# EAGLE design node (EAGLE 9.6.2)
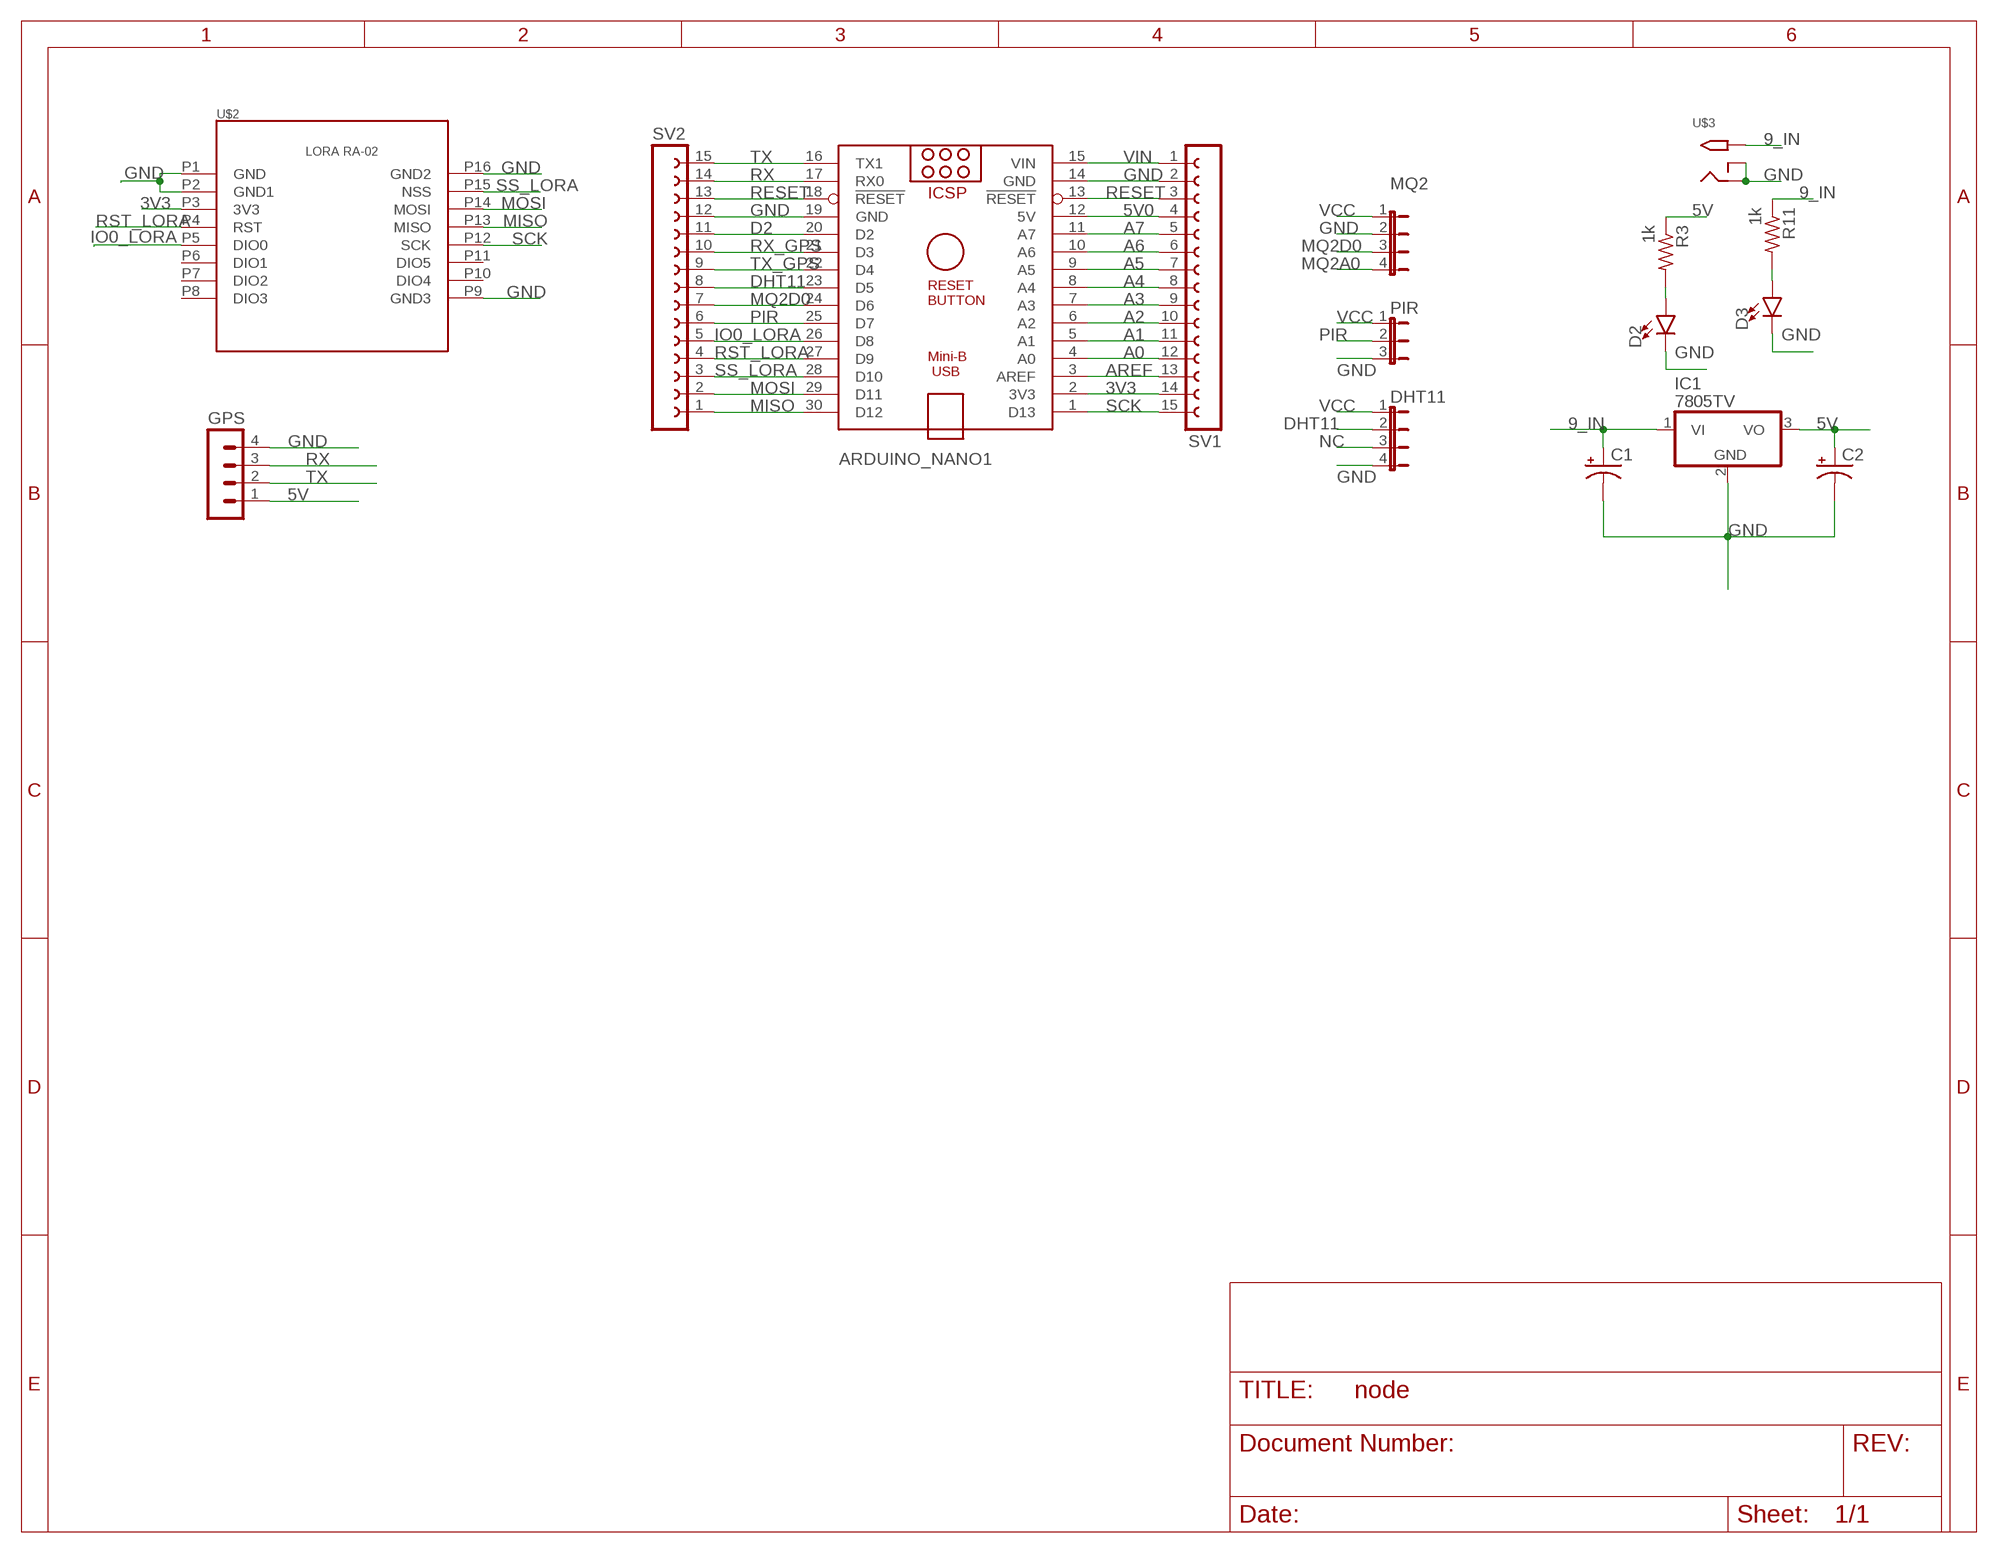
[diagram p0: schematic, sheet 1]

## Parts
ARDUINO_NANO1  ARDUINO_NANO  [ARDUINO_NANO]
C1  CPOL-USE3.5-8  [E3,5-8]
C2  CPOL-USE3.5-8  [E3,5-8]
D2  LED3MM  [LED_3MM]
D3  LED3MM  [LED_3MM]
DHT11  JP4E  [JP4]
GPS  MA04-1  [MA04-1]
IC1  7805TV  [TO220V]
MQ2  JP4E  [JP4]
PIR  JP2E  [JP2]
R3  1k  R-US_M0805  [M0805]
R11  1k  R-US_M0805  [M0805]
SV1  FE15-1  [FE15]
SV2  FE15-1  [FE15]
U$2  LORA_RA-02  [RA-02]
U$3  2.1MMJACKTHM  [PJ-102A]

## Nets
3V3: ARDUINO_NANO1.2(3V3) SV1.14 U$2.P3(3V3)
5V: C2.+ GPS.1 IC1.3(VO) R3.1
5V0: ARDUINO_NANO1.12(5V) SV1.4
9_IN: C1.+ IC1.1(VI) R11.1 U$3.TIP
A0: ARDUINO_NANO1.4(A0) SV1.12
A1: ARDUINO_NANO1.5(A1) SV1.11
A2: ARDUINO_NANO1.6(A2) SV1.10
A3: ARDUINO_NANO1.7(A3) SV1.9
A4: ARDUINO_NANO1.8(A4) SV1.8
A5: ARDUINO_NANO1.9(A5) SV1.7
A6: ARDUINO_NANO1.10(A6) SV1.6
A7: ARDUINO_NANO1.11(A7) SV1.5
AREF: ARDUINO_NANO1.3(AREF) SV1.13
D2: ARDUINO_NANO1.20(D2) SV2.11
DHT11: ARDUINO_NANO1.23(D5) DHT11.2 SV2.8
GND: ARDUINO_NANO1.14(GND) ARDUINO_NANO1.19(GND) C1.- C2.- D2.K(C) D3.K(C) DHT11.4 GPS.4 IC1.2(GND) MQ2.2 PIR.3 SV1.2 SV2.12 U$2.P1(GND) U$2.P2(GND1) U$2.P9(GND3) U$2.P16(GND2) U$3.RING U$3.RING_SW
IO0_LORA: ARDUINO_NANO1.26(D8) SV2.5 U$2.P5(DIO0)
MISO: ARDUINO_NANO1.30(D12) SV2.1 U$2.P13(MISO)
MOSI: ARDUINO_NANO1.29(D11) SV2.2 U$2.P14(MOSI)
MQ2A0: MQ2.4
MQ2D0: ARDUINO_NANO1.24(D6) MQ2.3 SV2.7
N$2: D3.A R11.2
N$5: D2.A R3.2
NC: DHT11.3
PIR: ARDUINO_NANO1.25(D7) PIR.2 SV2.6
RESET: ARDUINO_NANO1.13(!RESET) ARDUINO_NANO1.18(!RESET) SV1.3 SV2.13
RST_LORA: ARDUINO_NANO1.27(D9) SV2.4 U$2.P4(RST)
RX: ARDUINO_NANO1.17(RX0) GPS.3 SV2.14
RX_GPS: ARDUINO_NANO1.21(D3) SV2.10
SCK: ARDUINO_NANO1.1(D13) SV1.15 U$2.P12(SCK)
SS_LORA: ARDUINO_NANO1.28(D10) SV2.3 U$2.P15(NSS)
TX: ARDUINO_NANO1.16(TX1) GPS.2 SV2.15
TX_GPS: ARDUINO_NANO1.22(D4) SV2.9
VCC: DHT11.1 MQ2.1 PIR.1
VIN: ARDUINO_NANO1.15(VIN) SV1.1
Unconnected: U$2.P6(DIO1) U$2.P7(DIO2) U$2.P8(DIO3) U$2.P10(DIO4) U$2.P11(DIO5)

## Library data of the parts
ARDUINO_NANO1 = ArduinoNanoV30:ARDUINO_NANO: Arduino Nano V3.0 Overview: The Arduino Nano is a small, complete, and breadboard-friendly board based on the ATmega328 (Arduino Nano 3.x) or ATmega168 (Arduino Nano 2.x). It has more or less the same functionality of the Arduino Duemilanove, but in a different package. It lacks only a DC power jack, and works with a Mini-B USB cable instead of a standard one. The Nano was designed and is being produced by Gravitech. Specifications: Microcontroller Atmel ATmega168 or ATmega328 Operating Voltage (logic level) 5 V Input Voltage (recommended) 7-12 V Input Voltage (limits) 6-20 V Digital I/O Pins 14 (of which 6 provide PWM output) Analog Input Pins 8 DC Current per I/O Pin 40 mA Flash Memory 16 KB (ATmega168) or 32 KB (ATmega328) of which 2 KB used by bootloader SRAM 1 KB (ATmega168) or 2 KB (ATmega328) EEPROM 512 bytes (ATmega168) or 1 KB (ATmega328) Clock Speed 16 MHz Dimensions 0.73" x 1.70" Length 45 mm Width 18 mm Weigth 5 g Power: The Arduino Nano can be powered via the Mini-B USB connection, 6-20V unregulated external power supply (pin 30), or 5V regulated external power supply (pin 27). The power source is automatically selected to the highest voltage source. Memory: The ATmega168 has 16 KB of flash memory for storing code (of which 2 KB is used for the bootloader); the ATmega328 has 32 KB, (also with 2 KB used for the bootloader). The ATmega168 has 1 KB of SRAM and 512 bytes of EEPROM (which can be read and written with the EEPROM library); the ATmega328 has 2 KB of SRAM and 1 KB of EEPROM. Input and Output: Each of the 14 digital pins on the Nano can be used as an input or output, using pinMode(), digitalWrite(), and digitalRead() functions. They operate at 5 volts. Each pin can provide or receive a maximum of 40 mA and has an internal pull-up resistor (disconnected by default) of 20-50 kOhms. In addition, some pins have specialized functions. Visit Arduino - ArduinoBoardNano <https://www.arduino.cc/en/Main/ArduinoBoardNano>
C1 C2 = adafruit:CPOL-US: POLARIZED CAPACITOR, American symbol
D2 D3 = SparkFun-LED:LED: LED (Generic) Standard schematic elements and footprints for 5mm, 3mm, 1206, and 0603 sized LEDs. Generic LEDs with no color specified.; PROD_ID: DIO-08794
DHT11 MQ2 = jumper:JP4E: JUMPER
GPS = con-lstb:MA04-1: PIN HEADER; OC_FARNELL: unknown; OC_NEWARK: unknown
IC1 = linear:78*: Positive VOLTAGE REGULATOR Source: http://cache.national.com/ds/LM/LM78L05.pdf http://www.fairchildsemi.com/ds/LM/LM7805.pdf
PIR = jumper:JP2E: JUMPER
R3 R11 = adafruit:R-US_: RESISTOR, American symbol
SV1 SV2 = con-lsta:FE15-1: FEMALE HEADER; OC_FARNELL: unknown; OC_NEWARK: unknown
U$2 = LORA RA-02:LORA_RA-02
U$3 = adafruit:2.1MMJACK: 2.1mm x 5.5mm THM DC jack with internal switch. Digikey part #PJ-102A, 4UCON part #05537 2.1mm x 5.5mm SMT DC jack with internal switch. Digikey part #PJ-002A-SMT, 4UCON part #03267 By microbuilder.eu & adafruit.com

## Board
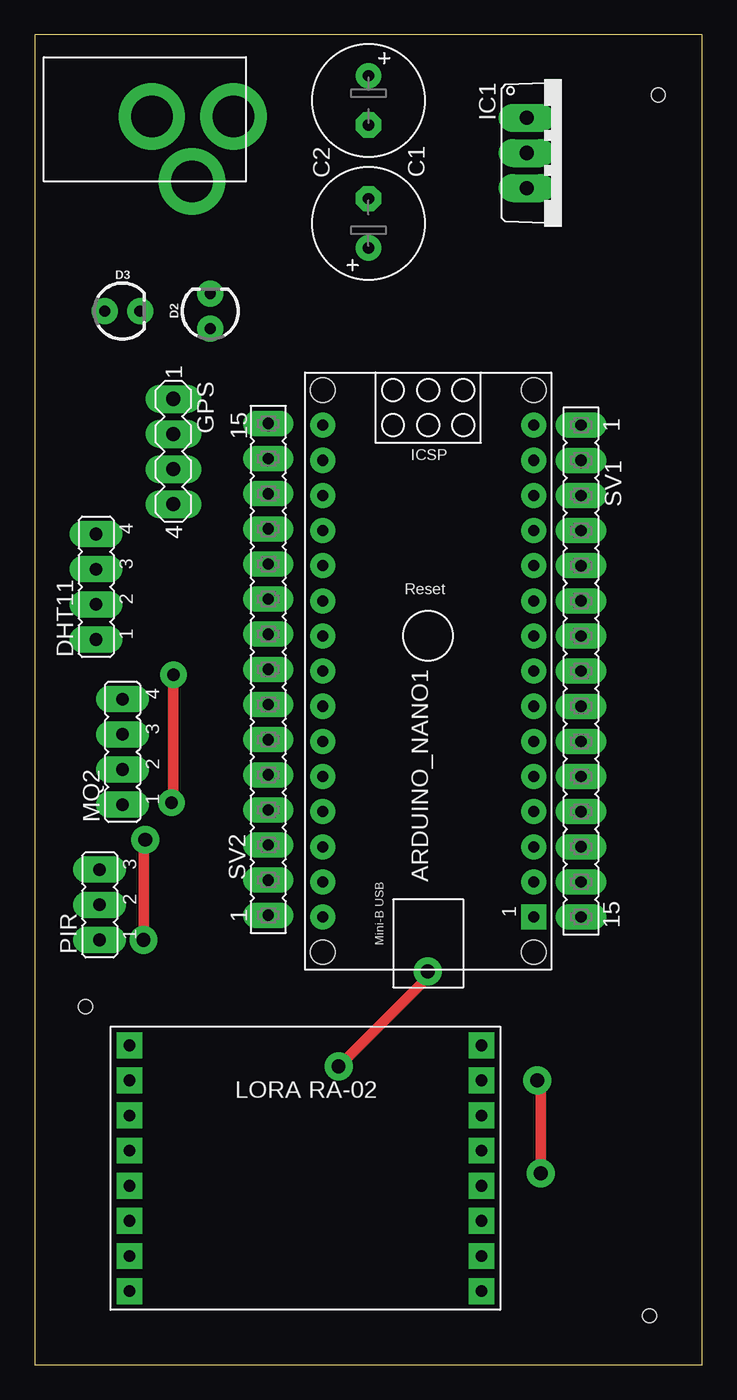
[diagram p1: board, top side]
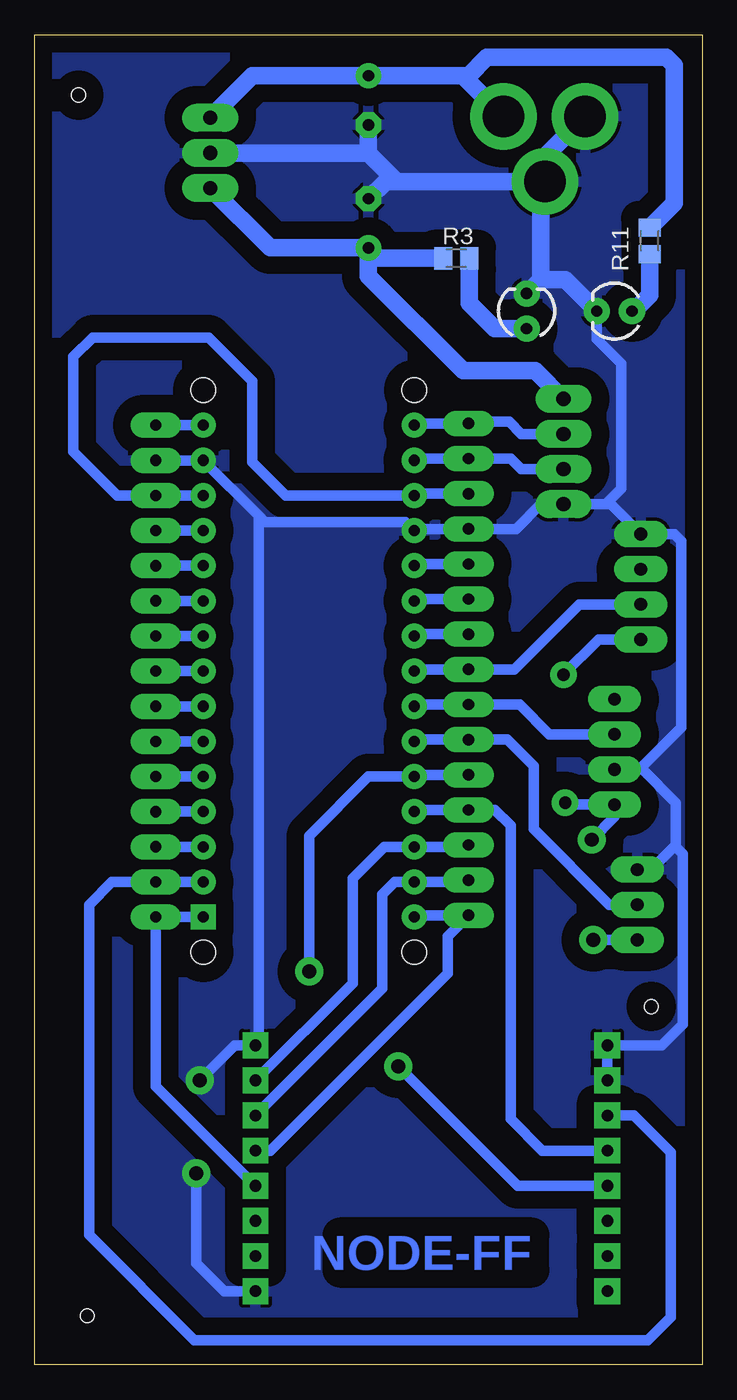
[diagram p2: board, bottom side, seen from below]

Size 48.26 x 96.19 mm. Coordinates in mm from the lower left corner, seen from the top.
Outline: 0,0 48.26,0 48.26,96.19 0,96.19 0,0
Copper layers (1*16): Top 0.035mm / dielectric 1.5mm / Bottom 0.035mm
Design rules "default *": minimum track width 30mil, minimum drill 1mm, track to track 6mil, track to pad 6mil, pad to pad 6mil, via to via 6mil, smd to smd 6mil, copper to edge 40mil, drill to drill 6mil, minimum pad ring 20mil, minimum via ring 20mil, stop-mask expansion 4mil, vias tented up to drill 0mil, thermal gap 10mil
Holes 1 mm at 45.09,91.82 3.68,25.91 44.45,3.56

### Footprints (pad centres in the part's own frame; a part is rotated, then mirrored left to right if it is on the bottom)
ARDUINO_NANO = drill 0.8 square: 1 -20.32,-7.62 | drill 0.8: 2 -17.78,-7.62; 3 -15.24,-7.62; 4 -12.7,-7.62; 5 -10.16,-7.62; 6 -7.62,-7.62; 7 -5.08,-7.62; 8 -2.54,-7.62; 9 0,-7.62; 10 2.54,-7.62; 11 5.08,-7.62; 12 7.62,-7.62; 13 10.16,-7.62; 14 12.7,-7.62; 15 15.24,-7.62; 16 15.24,7.62; 17 12.7,7.62; 18 10.16,7.62; 19 7.62,7.62; 20 5.08,7.62; 21 2.54,7.62; 22 0,7.62; 23 -2.54,7.62; 24 -5.08,7.62; 25 -7.62,7.62; 26 -10.16,7.62; 27 -12.7,7.62; 28 -15.24,7.62; 29 -17.78,7.62; 30 -20.32,7.62 | hole 1.778: -22.86,-7.62; -22.86,7.62; 17.78,7.62; 17.78,-7.62
E3,5-8 = drill 0.813 pad 1.6: + -1.778,0 | drill 0.813 pad 1.6 octagon: - 1.778,0
LED_3MM = drill 0.813 pad 1.88: A -1.27,0; K 1.27,0
JP4 = drill 0.914 long: 1 -3.81,0; 2 -1.27,0; 3 1.27,0; 4 3.81,0
MA04-1 = drill 1.016 long: 1 -3.81,0; 2 -1.27,0; 3 1.27,0; 4 3.81,0
TO220V = drill 1.016 long: 1 -2.54,-2.54; 2 0,-2.54; 3 2.54,-2.54
JP2 = drill 0.914 long: 1 -2.54,0; 2 0,0; 3 2.54,0
M0805 = smd 1.3 x 1.6: 1 -0.95,0; 2 0.95,0
FE15 = drill 0.813 long: 1 -17.78,0; 2 -15.24,0; 3 -12.7,0; 4 -10.16,0; 5 -7.62,0; 6 -5.08,0; 7 -2.54,0; 8 0,0; 9 2.54,0; 10 5.08,0; 11 7.62,0; 12 10.16,0; 13 12.7,0; 14 15.24,0; 15 17.78,0
RA-02 = drill 0.85 square: P1 0,0; P2 0,-2.54; P3 0,-5.08; P4 0,-7.62; P5 0,-10.16; P6 0,-12.7; P7 0,-15.24; P8 0,-17.78; P9 25.44,-17.78; P10 25.44,-15.24; P11 25.44,-12.7; P12 25.44,-10.16; P13 25.44,-7.62; P14 25.44,-5.08; P15 25.44,-2.54; P16 25.44,0
PJ-102A = drill 3 pad 4.8: RING 0.1,-3.39; RING_SW -4.6,-6.29; TIP 0.1,-9.29

### Placement (x,y rotation side)
ARDUINO_NANO1  28.45,52.7 90 top
C1  24.13,91.44 270 top
C2  24.13,82.55 90 top
D2  12.7,76.2 90 top
D3  6.35,76.2 0 top
DHT11  4.45,56.26 90 top
GPS  10.03,66.04 270 top
IC1  38.1,87.63 270 top
MQ2  6.35,44.32 90 top
PIR  4.7,33.27 90 top
R3  17.78,80.01 0 bottom
R11  3.81,81.28 270 bottom
SV1  39.5,50.16 270 top
SV2  16.89,50.29 90 top
U$2  6.86,23.11 0 top
U$3  5.08,90.17 90 top

### Tracks (layer width: path | path; a pad name or v marks a point on that pad's centre or on a via)
3V3
  Bottom 0.762: U$2.P3 4.95,18.03 2.29,15.37 2.29,3.43 3.94,1.78 36.7,1.78 44.32,9.4 44.32,33.27 42.67,34.92 SV1.14 ARDUINO_NANO1.2
5V
  Bottom 1.27: C2.+ 31.24,80.77 IC1.3 | C2.+ 23.37,80.01 R3.1 | C2.+ 24.13,78.74 17.27,71.88 12.06,71.88 GPS.1
5V0
  Bottom 0.762: ARDUINO_NANO1.12 SV1.4
9_IN
  Bottom 1.27: U$3.TIP 17.32,93.22 | 17.32,93.22 C1.+ 32.51,93.22 IC1.1 | 17.32,93.22 16.89,93.22 15.57,94.54 2.59,94.54 2.03,93.98 2.03,84.01 R11.1
A0
  Bottom 0.762: ARDUINO_NANO1.4 SV1.12
A1
  Bottom 0.762: ARDUINO_NANO1.5 SV1.11
A2
  Bottom 0.762: ARDUINO_NANO1.6 SV1.10
A3
  Bottom 0.762: ARDUINO_NANO1.7 SV1.9
A4
  Bottom 0.762: ARDUINO_NANO1.8 SV1.8
A5
  Bottom 0.762: ARDUINO_NANO1.9 SV1.7
A6
  Bottom 0.762: ARDUINO_NANO1.10 SV1.6
A7
  Bottom 0.762: ARDUINO_NANO1.11 SV1.5
AREF
  Bottom 0.762: ARDUINO_NANO1.3 SV1.13
D2
  Bottom 0.762: SV2.11 20.7,57.91 ARDUINO_NANO1.20
DHT11
  Bottom 0.762: DHT11.2 8.89,54.99 13.59,50.29 SV2.8 20.7,50.29 ARDUINO_NANO1.23
GND  (via drill 1)
  Top 0.762: v36.32,20.57 36.58,20.32 v36.58,13.84
  Bottom 0.762: 6.99,62.23 6.6,62.23 DHT11.4 2.03,60.07 1.52,59.56 1.52,46.1 4.57,43.05 MQ2.2 4.32,43.05 1.91,40.64 1.91,37.59 | 6.99,62.23 GPS.4 11.68,62.23 13.46,60.45 SV2.12 20.7,60.45 ARDUINO_NANO1.19 21.46,60.96 31.62,60.96 32.07,61.41 | D3.K 7.62,74.17 5.84,72.39 5.84,63.37 6.99,62.23 | 1.91,37.59 3.68,35.81 PIR.3 | 1.91,37.59 1.91,37.46 1.4,36.96 1.4,24.64 2.92,23.11 U$2.P1 U$2.P2 | 32.07,61.41 ARDUINO_NANO1.14 SV1.2 | v36.32,20.57 33.78,23.11 U$2.P16 32.07,23.34 32.07,61.41 | v36.58,13.84 36.58,7.37 34.54,5.33 U$2.P9
  Bottom 1.27: U$3.RING 11.68,87.06 11.68,78.49 | 11.68,78.49 D2.K | D3.K 9.91,78.49 11.68,78.49 | U$3.RING_SW 22.1,85.57 | 22.1,85.57 22.89,85.57 C2.- | 22.1,85.57 24.13,87.6 | 24.13,87.6 C1.- | 24.13,87.6 24.16,87.63 IC1.2
  pour Bottom (isolate 1.27): 0,0 0,96.01 48.39,96.01 48.39,0
IO0_LORA  (via drill 1)
  Top 0.762: 28.19,28.23 v28.41,28.45 28.41,28.03 v21.97,21.59
  Bottom 0.762: 6.99,12.83 U$2.P5 13.34,12.95 v21.97,21.59 | v28.41,28.45 28.41,38.26 24.13,42.54 ARDUINO_NANO1.26 20.7,42.67 SV2.5
MISO
  Bottom 0.762: U$2.P13 31.24,15.49 18.41,28.32 18.41,30.99 SV2.1 20.7,32.51 ARDUINO_NANO1.30
MOSI
  Bottom 0.762: U$2.P14 23.11,27.22 23.11,34.04 22.23,34.92 ARDUINO_NANO1.29 17.02,34.92 SV2.2
MQ2D0
  Bottom 0.762: MQ2.3 11.05,45.59 13.21,47.75 SV2.7 20.7,47.75 ARDUINO_NANO1.24
N$2
  Bottom 1.27: R11.2 3.81,77.34 4.95,76.2 D3.A
N$5
  Bottom 1.27: D2.A 14.99,74.93 16.83,76.77 R3.2
PIR
  Bottom 0.762: PIR.2 6.73,33.27 12.19,38.73 12.19,43.31 14.1,45.21 SV2.6 20.7,45.21 ARDUINO_NANO1.25
RESET
  Bottom 0.762: SV2.13 20.7,62.99 ARDUINO_NANO1.18 30.1,62.86 32.51,65.28 32.51,71.12 35.69,74.3 44.07,74.3 45.47,72.9 45.47,66.04 42.29,62.86 39.75,62.86 SV1.3 ARDUINO_NANO1.13
RST_LORA
  Bottom 0.762: U$2.P4 11.56,15.49 13.84,17.78 13.84,38.99 14.99,40.13 SV2.4 20.7,40.13 ARDUINO_NANO1.27
RX
  Bottom 0.762: GPS.3 13.08,64.77 13.84,65.53 SV2.14 20.7,65.53 ARDUINO_NANO1.17
RX_GPS
  Bottom 0.762: SV2.10 20.7,55.37 ARDUINO_NANO1.21
SCK
  Bottom 0.762: U$2.P12 39.5,20.15 SV1.15 ARDUINO_NANO1.1
SS_LORA
  Bottom 0.762: SV2.3 17.02,37.46 ARDUINO_NANO1.28 22.99,37.46 25.27,35.18 25.27,27.6 U$2.P15
TX
  Bottom 0.762: GPS.2 13.08,67.31 13.97,68.2 16.76,68.2 SV2.15 20.7,68.07 ARDUINO_NANO1.16
TX_GPS
  Bottom 0.762: SV2.9 20.7,52.83 ARDUINO_NANO1.22
VCC  (via drill 0.9, 1)
  Top 0.762: v10.03,49.91 10.03,40.77 v9.91,40.64 | v7.87,30.73 7.87,37.85 v8,37.97
  Bottom 0.762: DHT11.1 7.49,52.45 v10.03,49.91 | v9.91,40.64 9.78,40.51 MQ2.1 6.35,39.62 v8,37.97 | PIR.1 v7.87,30.73
VIN
  Bottom 0.762: ARDUINO_NANO1.15 SV1.1

### Text on the board
Bottom: NODE-FF